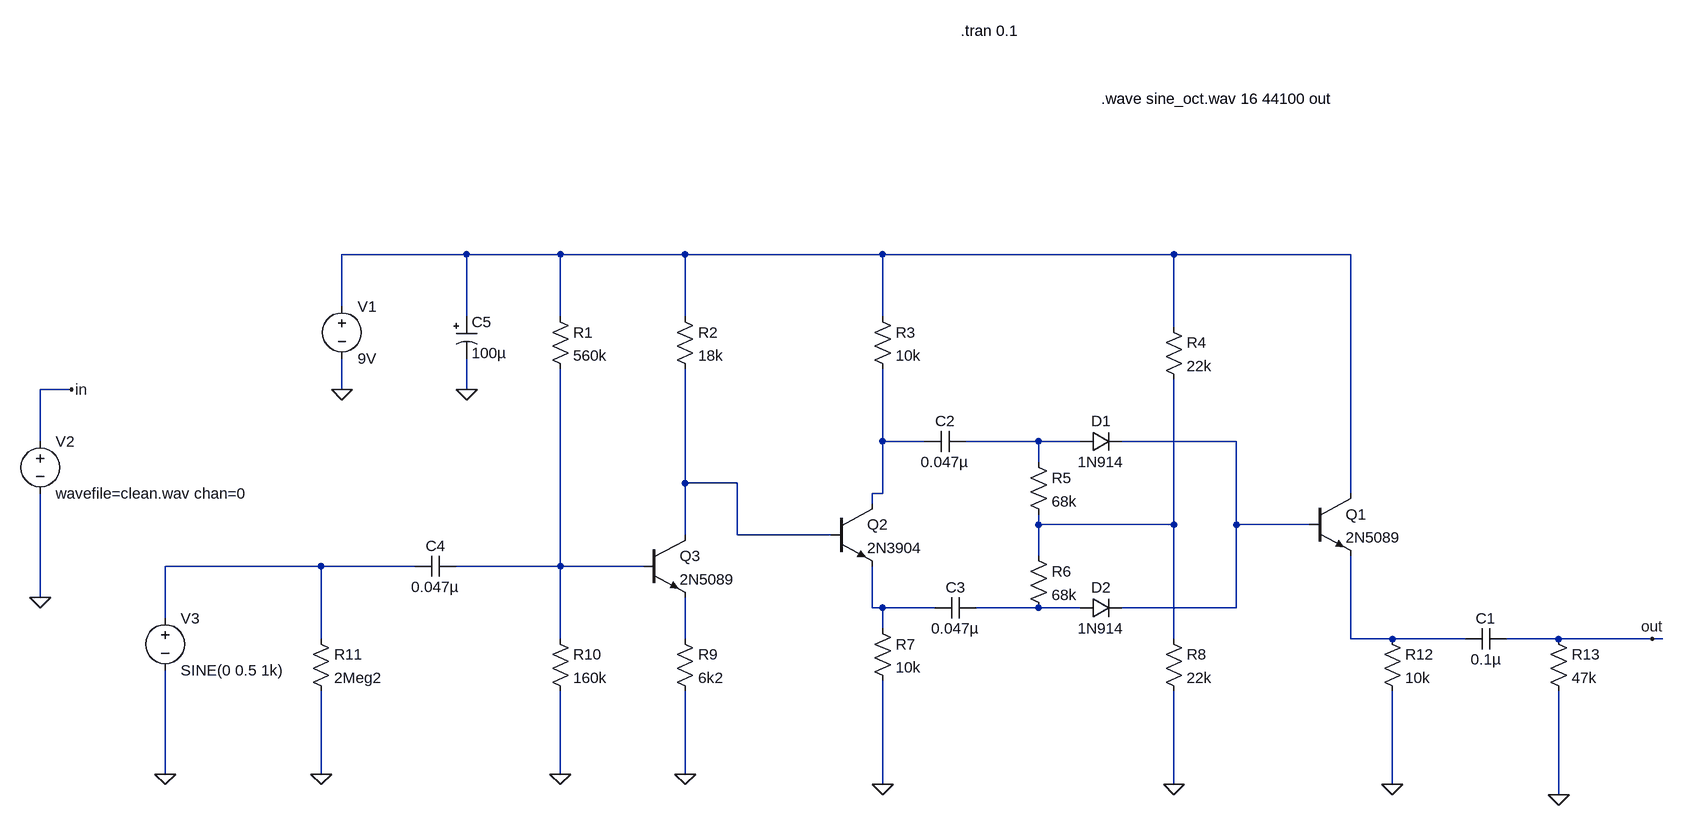
[diagram p0: schematic greenringer.asc]
greenringer.asc, the LTspice schematic file:
Version 4
SHEET 1 1956 820
WIRE 96 -32 -96 -32
WIRE 240 -32 96 -32
WIRE 432 -32 240 -32
WIRE 736 -32 432 -32
WIRE 1184 -32 736 -32
WIRE 1456 -32 1184 -32
WIRE -96 48 -96 -32
WIRE 96 64 96 -32
WIRE 240 64 240 -32
WIRE 432 64 432 -32
WIRE 736 64 736 -32
WIRE 1184 80 1184 -32
WIRE -512 176 -560 176
WIRE -96 176 -96 128
WIRE 96 176 96 128
WIRE -560 256 -560 176
WIRE 736 256 736 144
WIRE 800 256 736 256
WIRE 976 256 864 256
WIRE 1040 256 976 256
WIRE 1280 256 1104 256
WIRE 976 288 976 256
WIRE 432 320 432 144
WIRE 512 320 432 320
WIRE 736 336 736 256
WIRE 736 336 720 336
WIRE 1456 336 1456 -32
WIRE 720 352 720 336
WIRE 976 384 976 368
WIRE 1184 384 1184 160
WIRE 1184 384 976 384
WIRE 1280 384 1280 256
WIRE 1392 384 1280 384
WIRE 432 400 432 320
WIRE 512 400 512 320
WIRE 656 400 512 400
WIRE 976 432 976 384
WIRE -128 448 -368 448
WIRE 16 448 -128 448
WIRE 240 448 240 144
WIRE 240 448 80 448
WIRE 368 448 240 448
WIRE -560 496 -560 336
WIRE 720 512 720 448
WIRE 736 512 720 512
WIRE 816 512 736 512
WIRE 976 512 880 512
WIRE 1040 512 976 512
WIRE 1280 512 1280 384
WIRE 1280 512 1104 512
WIRE -368 528 -368 448
WIRE 736 544 736 512
WIRE -128 560 -128 448
WIRE 240 560 240 448
WIRE 432 560 432 496
WIRE 1184 560 1184 384
WIRE 1456 560 1456 432
WIRE 1520 560 1456 560
WIRE 1632 560 1520 560
WIRE 1776 560 1696 560
WIRE 1920 560 1776 560
WIRE 1936 560 1920 560
WIRE -368 768 -368 608
WIRE -128 768 -128 640
WIRE 240 768 240 640
WIRE 432 768 432 640
WIRE 736 784 736 624
WIRE 1184 784 1184 640
WIRE 1520 784 1520 640
WIRE 1776 800 1776 640
FLAG -128 768 0
FLAG 240 768 0
FLAG 432 768 0
FLAG 736 784 0
FLAG 1184 784 0
FLAG 1520 784 0
FLAG 1776 800 0
FLAG 96 176 0
FLAG -96 176 0
FLAG -560 496 0
FLAG -512 176 in
FLAG 1920 560 out
FLAG -368 768 0
SYMBOL res 224 48 R0
SYMATTR InstName R1
SYMATTR Value 560k
SYMBOL res 416 48 R0
SYMATTR InstName R2
SYMATTR Value 18k
SYMBOL res 720 48 R0
SYMATTR InstName R3
SYMATTR Value 10k
SYMBOL res 1168 64 R0
SYMATTR InstName R4
SYMATTR Value 22k
SYMBOL res 960 272 R0
SYMATTR InstName R5
SYMATTR Value 68k
SYMBOL res 960 416 R0
SYMATTR InstName R6
SYMATTR Value 68k
SYMBOL res 720 528 R0
SYMATTR InstName R7
SYMATTR Value 10k
SYMBOL res 1168 544 R0
SYMATTR InstName R8
SYMATTR Value 22k
SYMBOL res 416 544 R0
SYMATTR InstName R9
SYMATTR Value 6k2
SYMBOL res 224 544 R0
SYMATTR InstName R10
SYMATTR Value 160k
SYMBOL res -144 544 R0
SYMATTR InstName R11
SYMATTR Value 2Meg2
SYMBOL res 1504 544 R0
SYMATTR InstName R12
SYMATTR Value 10k
SYMBOL res 1760 544 R0
SYMATTR InstName R13
SYMATTR Value 47k
SYMBOL cap 1696 544 R90
WINDOW 0 0 32 VBottom 2
WINDOW 3 32 32 VTop 2
SYMATTR InstName C1
SYMATTR Value 0.1µ
SYMBOL cap 864 240 R90
WINDOW 0 0 32 VBottom 2
WINDOW 3 32 32 VTop 2
SYMATTR InstName C2
SYMATTR Value 0.047µ
SYMBOL cap 880 496 R90
WINDOW 0 0 32 VBottom 2
WINDOW 3 32 32 VTop 2
SYMATTR InstName C3
SYMATTR Value 0.047µ
SYMBOL cap 80 432 R90
WINDOW 0 0 32 VBottom 2
WINDOW 3 32 32 VTop 2
SYMATTR InstName C4
SYMATTR Value 0.047µ
SYMBOL diode 1040 272 R270
WINDOW 0 32 32 VTop 2
WINDOW 3 0 32 VBottom 2
SYMATTR InstName D1
SYMATTR Value 1N914
SYMBOL diode 1040 528 R270
WINDOW 0 32 32 VTop 2
WINDOW 3 0 32 VBottom 2
SYMATTR InstName D2
SYMATTR Value 1N914
SYMBOL npn 1392 336 R0
SYMATTR InstName Q1
SYMATTR Value 2N5089
SYMBOL npn 656 352 R0
SYMATTR InstName Q2
SYMATTR Value 2N3904
SYMBOL npn 368 400 R0
SYMATTR InstName Q3
SYMATTR Value 2N5089
SYMBOL polcap 80 64 R0
SYMATTR InstName C5
SYMATTR Value 100µ
SYMBOL voltage -96 32 R0
SYMATTR InstName V1
SYMATTR Value 9V
SYMBOL voltage -560 240 R0
WINDOW 123 0 0 Left 0
WINDOW 39 0 0 Left 0
SYMATTR InstName V2
SYMATTR Value wavefile=clean.wav chan=0
SYMBOL voltage -368 512 R0
WINDOW 123 0 0 Left 0
WINDOW 39 0 0 Left 0
SYMATTR InstName V3
SYMATTR Value SINE(0 0.5 1k)
TEXT 1072 -272 Left 2 !.wave sine_oct.wav 16 44100 out
TEXT 856 -376 Left 2 !.tran 0.1

The netlist it stands for:
* greenringer.asc
R1 N001 N008 560k
R2 N001 N005 18k
R3 N001 N002 10k
R4 N001 N006 22k
R5 N003 N006 68k
R6 N006 N010 68k
R7 N009 0 10k
R8 N006 0 22k
R9 N011 0 6k2
R10 N008 0 160k
R11 N007 0 2Meg2
R12 N012 0 10k
R13 out 0 47k
C1 out N012 0.1µ
C2 N003 N002 0.047µ
C3 N010 N009 0.047µ
C4 N008 N007 0.047µ
D1 N003 N004 1N914
D2 N010 N004 1N914
Q1 N001 N004 N012 0 2N5089
Q2 N002 N005 N009 0 2N3904
Q3 N005 N008 N011 0 2N5089
C5 N001 0 100µ
V1 N001 0 9V
V2 in 0 wavefile=clean.wav chan=0
V3 N007 0 SINE(0 0.5 1k)
.model D D
.lib standard.dio
.model NPN NPN
.model PNP PNP
.lib standard.bjt
.wave sine_oct.wav 16 44100 out
.tran 0.1
.backanno
.end